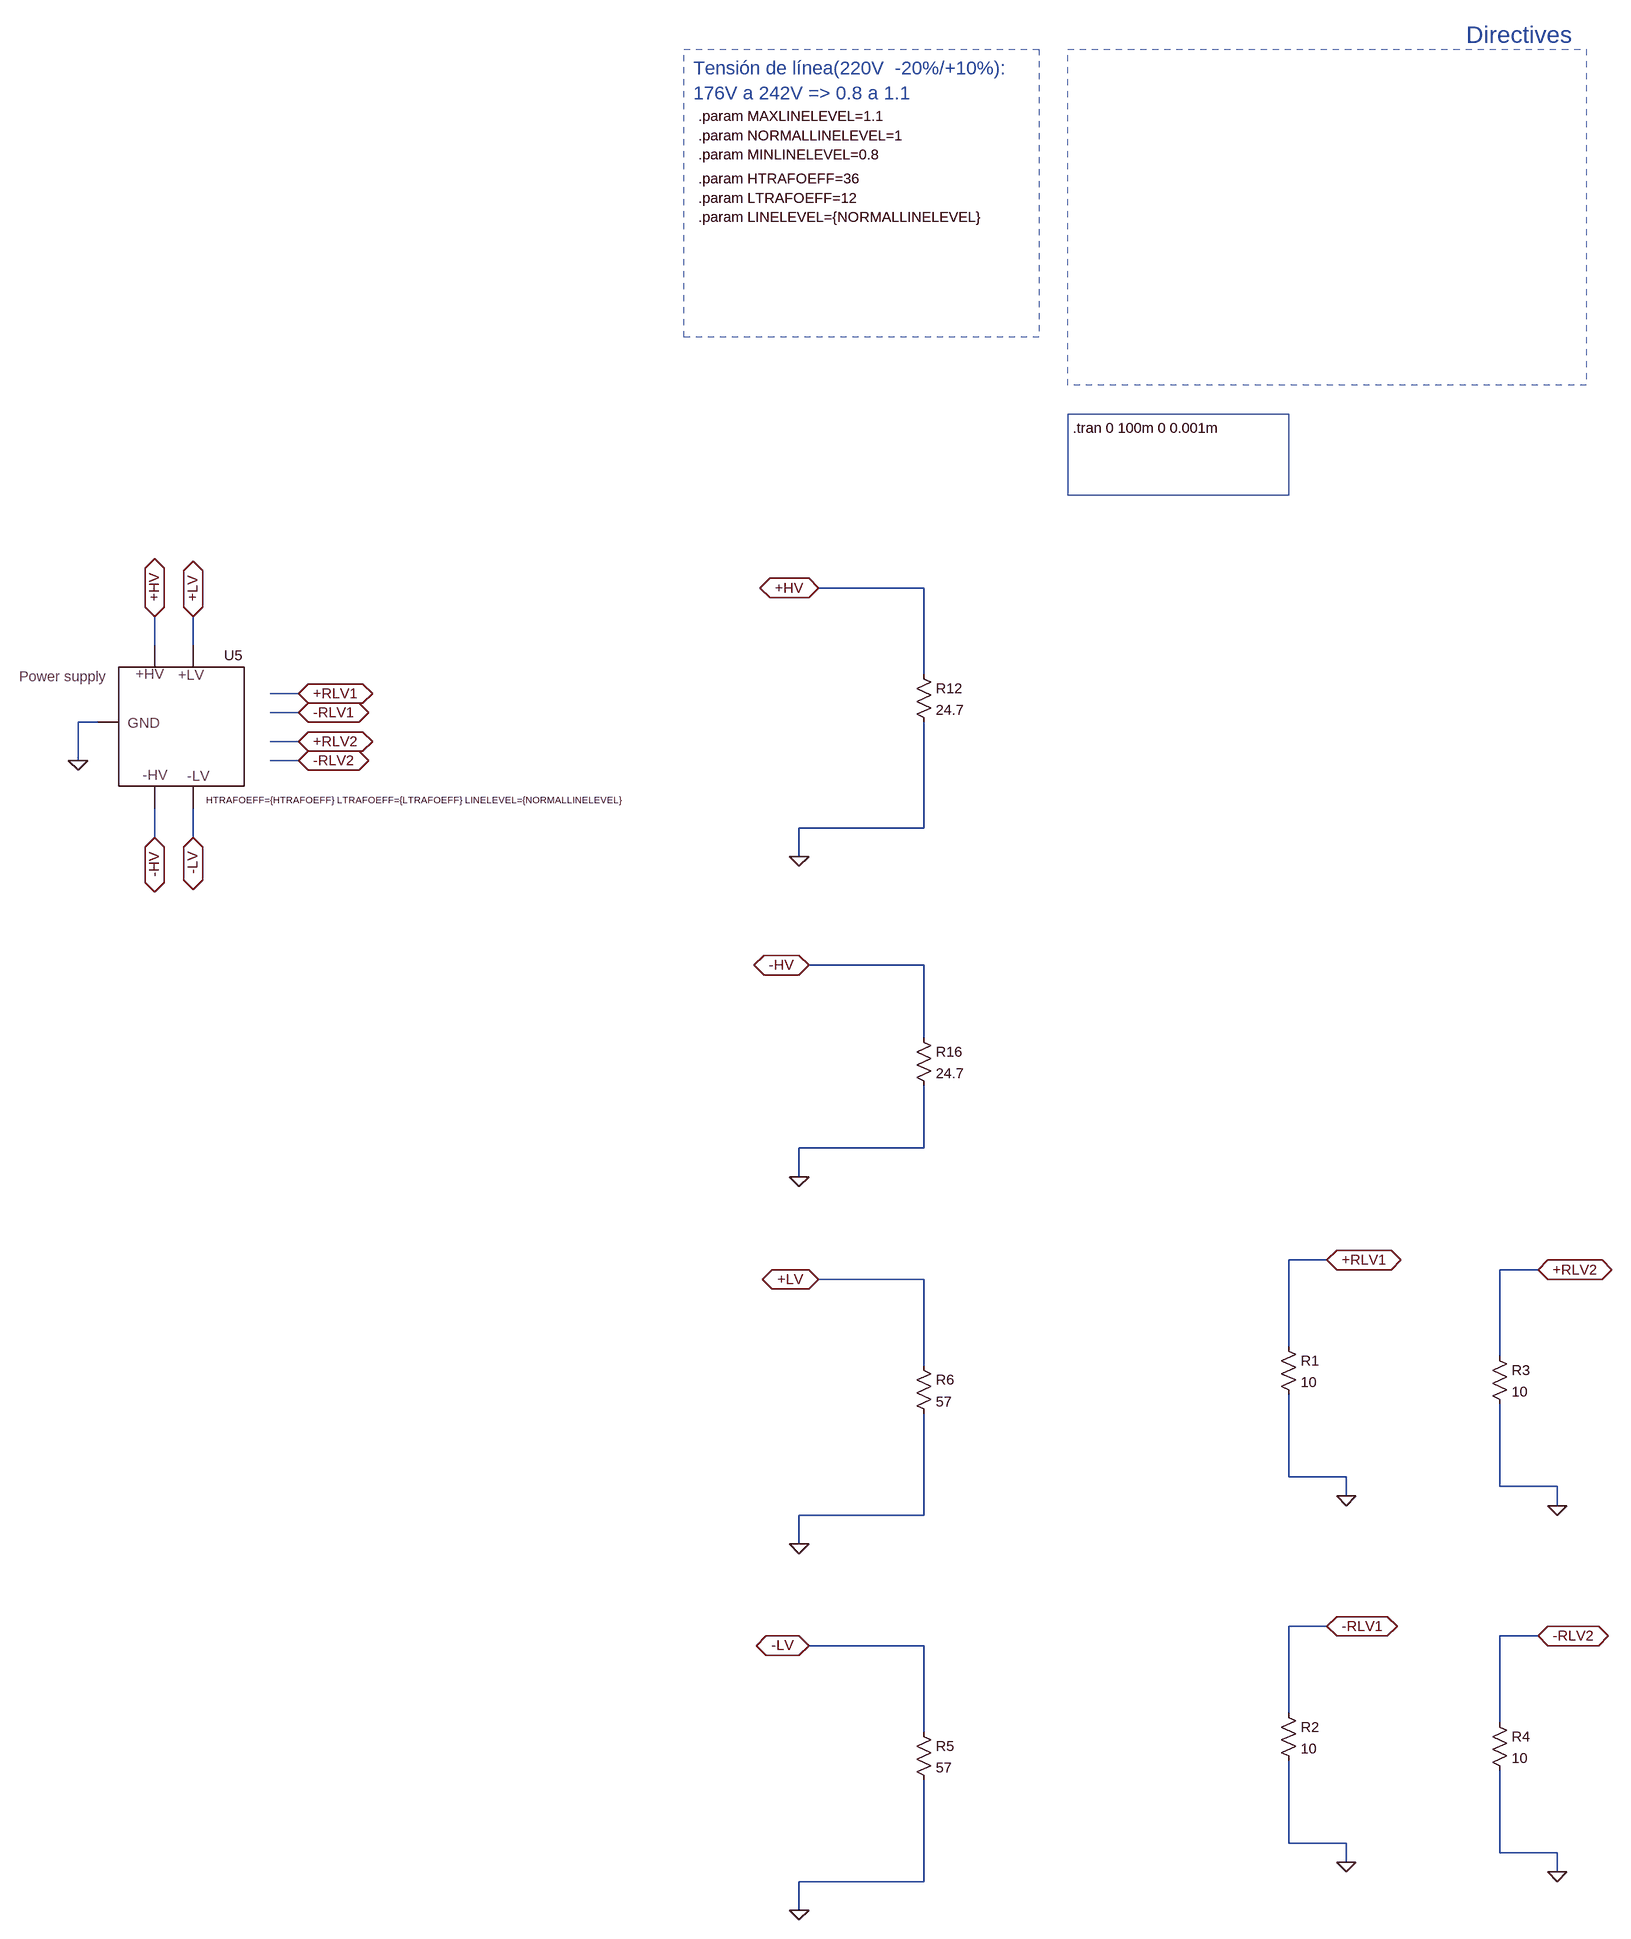
[diagram p0: schematic power_supply_V_2.0.asc]
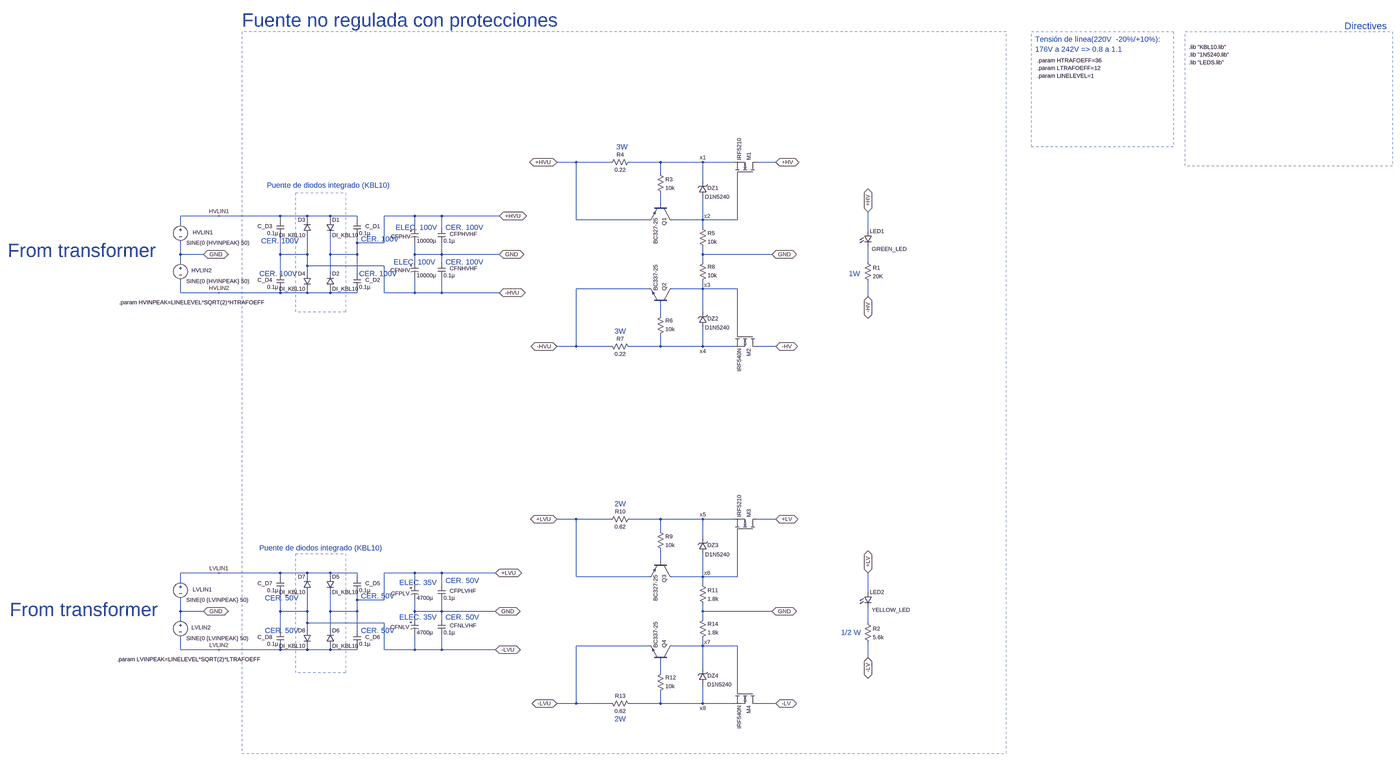
[diagram p1: sub-circuit power_supply_v_2.0_hb.asc, whole sheet]
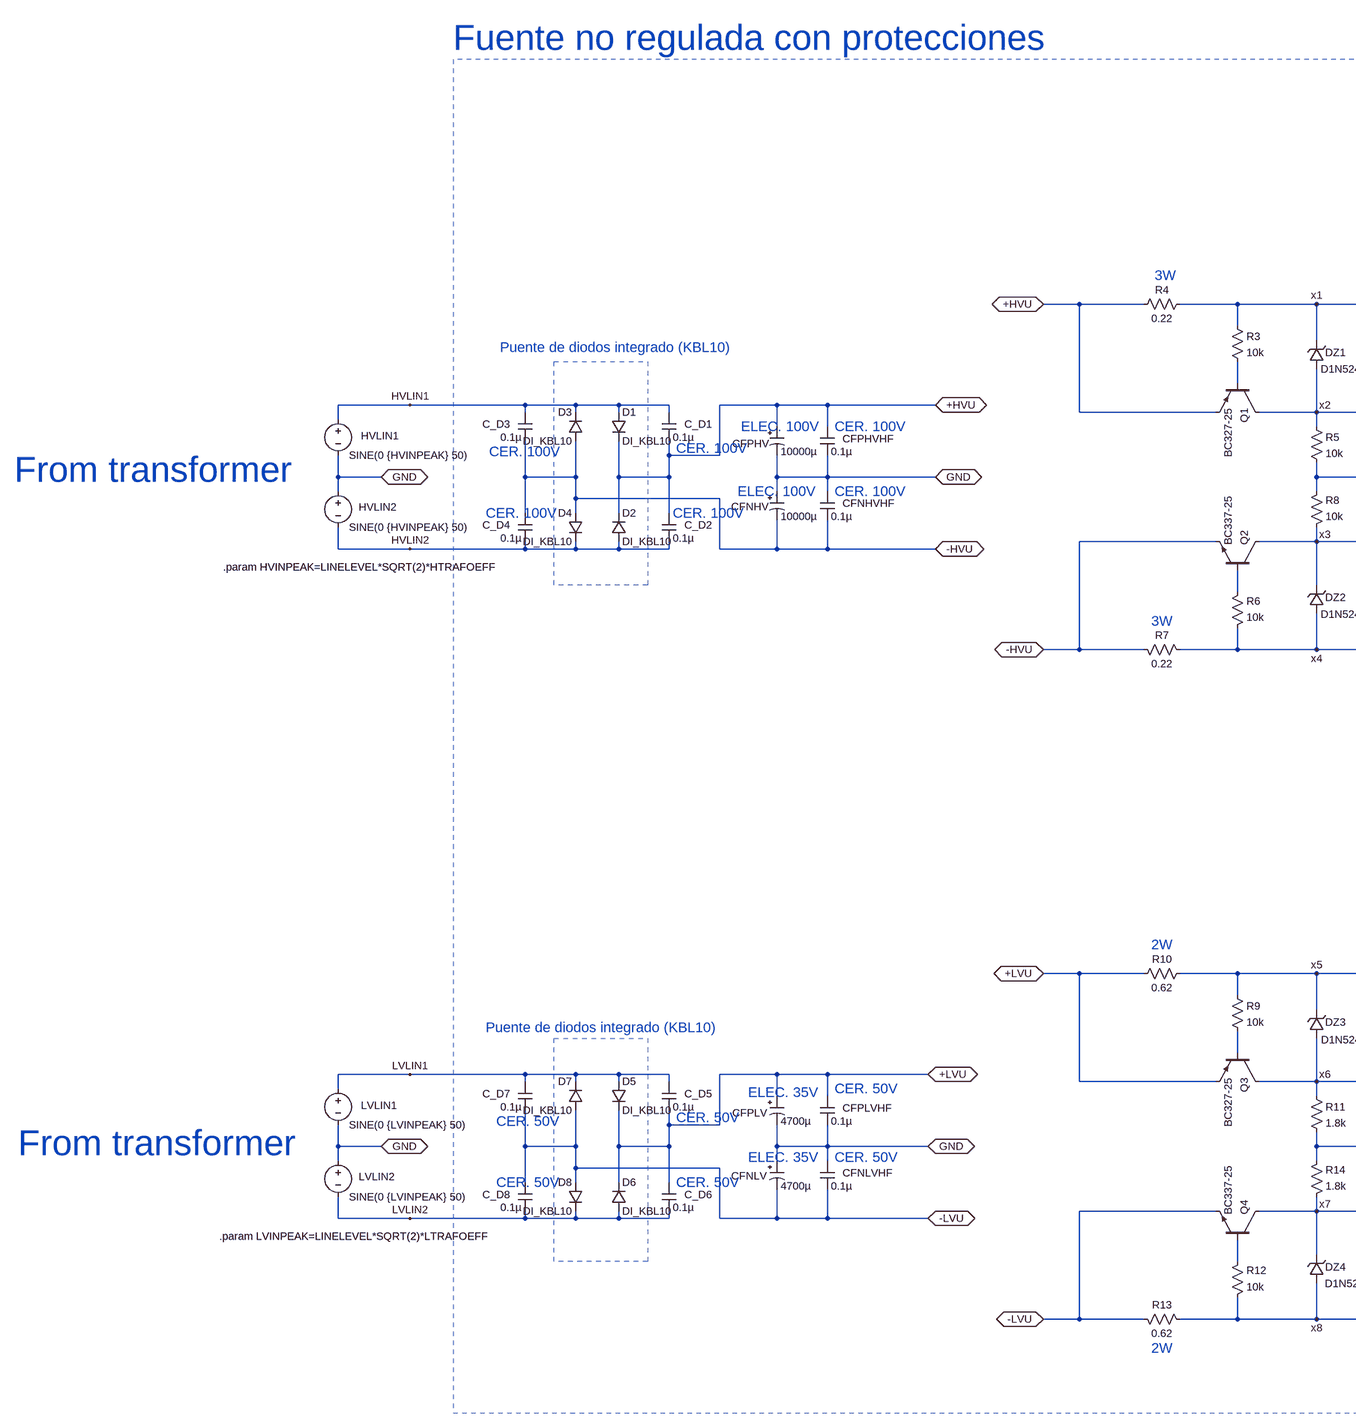
[diagram p2: sub-circuit power_supply_v_2.0_hb.asc, part, row 1 of 1, column 1 of 2]
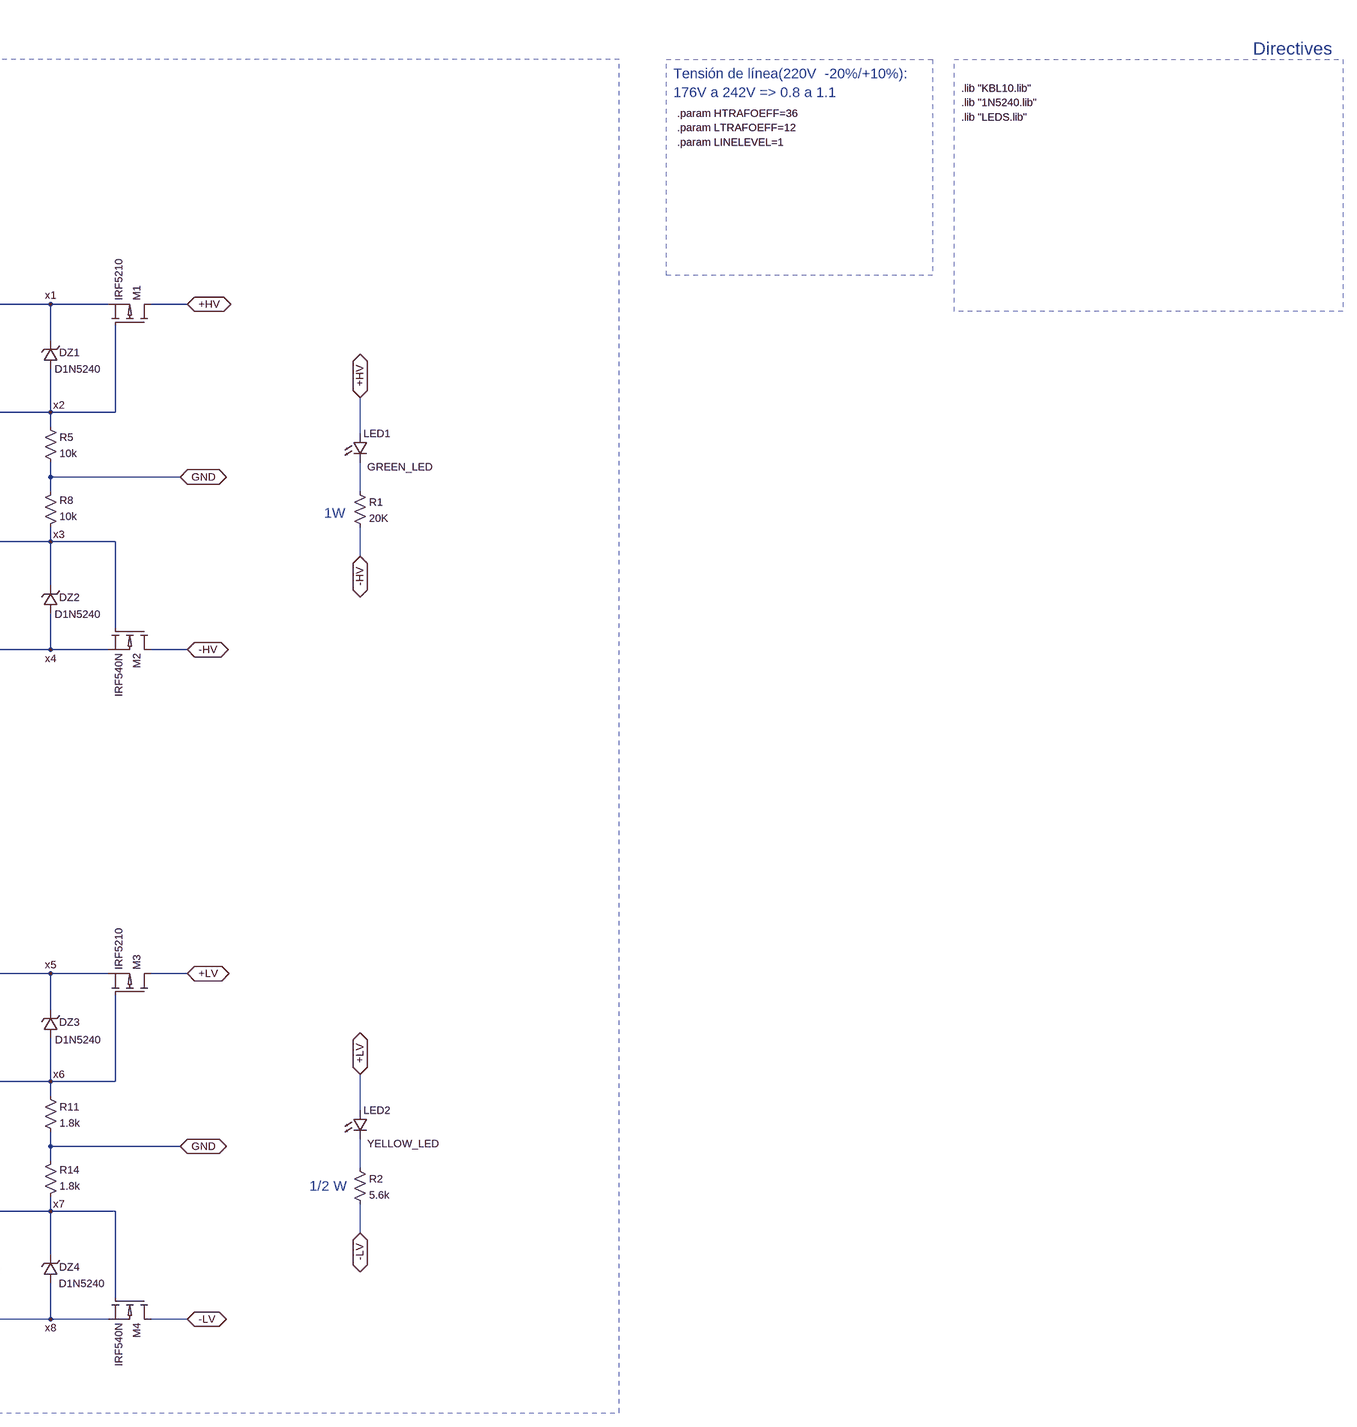
[diagram p3: sub-circuit power_supply_v_2.0_hb.asc, part, row 1 of 1, column 2 of 2]
power_supply_V_2.0.asc, the LTspice schematic file:
Version 4
SHEET 1 5728 3316
WIRE 3584 -688 3408 -688
WIRE 1920 -592 1920 -640
WIRE 1984 -592 1984 -640
WIRE 3584 -544 3584 -688
WIRE 2160 -512 2112 -512
WIRE 2160 -480 2112 -480
WIRE 1824 -464 1792 -464
WIRE 2160 -432 2112 -432
WIRE 1792 -400 1792 -464
WIRE 2160 -400 2112 -400
WIRE 3584 -288 3584 -464
WIRE 3584 -288 3376 -288
WIRE 1920 -272 1920 -320
WIRE 1984 -272 1984 -320
WIRE 3376 -240 3376 -288
WIRE 3584 16 3392 16
WIRE 3584 160 3584 16
WIRE 3584 416 3584 240
WIRE 3584 416 3376 416
WIRE 3376 464 3376 416
WIRE 4256 816 4192 816
WIRE 4608 832 4544 832
WIRE 3584 848 3408 848
WIRE 4192 960 4192 816
WIRE 4544 976 4544 832
WIRE 3584 992 3584 848
WIRE 4192 1184 4192 1040
WIRE 4288 1184 4192 1184
WIRE 4544 1200 4544 1056
WIRE 4640 1200 4544 1200
WIRE 4288 1216 4288 1184
WIRE 4640 1232 4640 1200
WIRE 3584 1248 3584 1072
WIRE 3584 1248 3376 1248
WIRE 3376 1296 3376 1248
WIRE 4256 1520 4192 1520
WIRE 4608 1536 4544 1536
WIRE 3584 1552 3392 1552
WIRE 4192 1664 4192 1520
WIRE 4544 1680 4544 1536
WIRE 3584 1696 3584 1552
WIRE 4192 1888 4192 1744
WIRE 4288 1888 4192 1888
WIRE 4544 1904 4544 1760
WIRE 4640 1904 4544 1904
WIRE 4288 1920 4288 1888
WIRE 4640 1936 4640 1904
WIRE 3584 1952 3584 1776
WIRE 3584 1952 3376 1952
WIRE 3376 2000 3376 1952
FLAG 3408 -688 +HV
IOPIN 3408 -688 BiDir
FLAG 3376 -240 0
FLAG 3392 16 -HV
IOPIN 3392 16 BiDir
FLAG 3376 464 0
FLAG 4256 816 +RLV1
IOPIN 4256 816 BiDir
FLAG 4288 1216 0
FLAG 4256 1520 -RLV1
IOPIN 4256 1520 BiDir
FLAG 4288 1920 0
FLAG 3408 848 +LV
IOPIN 3408 848 BiDir
FLAG 3376 1296 0
FLAG 3392 1552 -LV
IOPIN 3392 1552 BiDir
FLAG 3376 2000 0
FLAG 1792 -400 0
FLAG 1920 -640 +HV
IOPIN 1920 -640 BiDir
FLAG 1984 -640 +LV
IOPIN 1984 -640 BiDir
FLAG 1920 -272 -HV
IOPIN 1920 -272 BiDir
FLAG 1984 -272 -LV
IOPIN 1984 -272 BiDir
FLAG 2160 -432 +RLV2
IOPIN 2160 -432 BiDir
FLAG 2160 -400 -RLV2
IOPIN 2160 -400 BiDir
FLAG 4608 832 +RLV2
IOPIN 4608 832 BiDir
FLAG 4640 1232 0
FLAG 4608 1536 -RLV2
IOPIN 4608 1536 BiDir
FLAG 4640 1936 0
FLAG 2160 -512 +RLV1
IOPIN 2160 -512 BiDir
FLAG 2160 -480 -RLV1
IOPIN 2160 -480 BiDir
SYMBOL res 3568 -560 R0
SYMATTR InstName R12
SYMATTR Value 24.7
SYMBOL res 3568 144 R0
SYMATTR InstName R16
SYMATTR Value 24.7
SYMBOL power_supply_V_2.0_HB 1968 -448 R0
WINDOW 0 68 -127 Left 2
WINDOW 39 38 114 Left 1
SYMATTR InstName U5
SYMATTR SpiceLine HTRAFOEFF={HTRAFOEFF} LTRAFOEFF={LTRAFOEFF} LINELEVEL={NORMALLINELEVEL}
SYMBOL res 4176 944 R0
SYMATTR InstName R1
SYMATTR Value 10
SYMBOL res 4176 1648 R0
SYMATTR InstName R2
SYMATTR Value 10
SYMBOL res 4528 960 R0
SYMATTR InstName R3
SYMATTR Value 10
SYMBOL res 4528 1664 R0
SYMATTR InstName R4
SYMATTR Value 10
SYMBOL res 3568 1680 R0
SYMATTR InstName R5
SYMATTR Value 57
SYMBOL res 3568 976 R0
SYMATTR InstName R6
SYMATTR Value 57
TEXT 3832 -1064 Left 2 !.tran 0 100m 0 0.001m
TEXT 4488 -1720 Left 4 ;Directives
TEXT 3208 -1480 Left 2 !.param HTRAFOEFF=36
TEXT 3208 -1448 Left 2 !.param LTRAFOEFF=12
TEXT 3208 -1416 Left 2 !.param LINELEVEL={NORMALLINELEVEL}
TEXT 3200 -1664 Left 3 ;Tensión de línea(220V  -20%/+10%):\n176V a 242V => 0.8 a 1.1
TEXT 3208 -1584 Left 2 !.param MAXLINELEVEL=1.1
TEXT 3208 -1520 Left 2 !.param MINLINELEVEL=0.8
TEXT 3208 -1552 Left 2 !.param NORMALLINELEVEL=1
RECTANGLE Normal 4688 -1136 3824 -1696 3
RECTANGLE Normal 3776 -1216 3184 -1696 2
RECTANGLE Normal 4192 -928 3824 -1088

power_supply_v_2.0_hb.asc, the sub-circuit schematic file:
Version 4
SHEET 1 5728 3316
WIRE -2768 -480 -2848 -480
WIRE -2624 -480 -2768 -480
WIRE -2416 -480 -2544 -480
WIRE -2240 -480 -2416 -480
WIRE -2112 -480 -2240 -480
WIRE -1936 -480 -2016 -480
WIRE -2416 -432 -2416 -480
WIRE -2240 -400 -2240 -480
WIRE -2416 -304 -2416 -352
WIRE -4256 -256 -4416 -256
WIRE -4000 -256 -4256 -256
WIRE -3888 -256 -4000 -256
WIRE -3792 -256 -3888 -256
WIRE -3680 -256 -3792 -256
WIRE -3440 -256 -3568 -256
WIRE -3328 -256 -3440 -256
WIRE -3088 -256 -3328 -256
WIRE -4000 -240 -4000 -256
WIRE -3888 -240 -3888 -256
WIRE -3792 -240 -3792 -256
WIRE -3680 -240 -3680 -256
WIRE -2768 -240 -2768 -480
WIRE -2464 -240 -2768 -240
WIRE -2240 -240 -2240 -336
WIRE -2240 -240 -2368 -240
WIRE -2096 -240 -2096 -432
WIRE -2096 -240 -2240 -240
WIRE -4416 -224 -4416 -256
WIRE -3440 -208 -3440 -256
WIRE -3328 -208 -3328 -256
WIRE -2240 -208 -2240 -240
WIRE -1552 -192 -1552 -272
WIRE -3680 -144 -3680 -176
WIRE -3568 -144 -3568 -256
WIRE -3568 -144 -3680 -144
WIRE -4416 -96 -4416 -144
WIRE -4320 -96 -4416 -96
WIRE -4000 -96 -4000 -176
WIRE -3888 -96 -3888 -176
WIRE -3888 -96 -4000 -96
WIRE -3792 -96 -3792 -176
WIRE -3680 -96 -3680 -144
WIRE -3680 -96 -3792 -96
WIRE -3440 -96 -3440 -144
WIRE -3328 -96 -3328 -144
WIRE -3328 -96 -3440 -96
WIRE -3088 -96 -3328 -96
WIRE -2240 -96 -2240 -128
WIRE -1952 -96 -2240 -96
WIRE -4416 -64 -4416 -96
WIRE -3440 -64 -3440 -96
WIRE -3328 -64 -3328 -96
WIRE -2240 -64 -2240 -96
WIRE -1552 -64 -1552 -128
WIRE -3888 -48 -3888 -96
WIRE -3568 -48 -3888 -48
WIRE -4000 -16 -4000 -96
WIRE -3888 -16 -3888 -48
WIRE -3792 -16 -3792 -96
WIRE -3680 -16 -3680 -96
WIRE -2464 48 -2768 48
WIRE -2240 48 -2240 16
WIRE -2240 48 -2368 48
WIRE -2096 48 -2240 48
WIRE -4416 64 -4416 16
WIRE -4256 64 -4416 64
WIRE -4000 64 -4000 48
WIRE -4000 64 -4256 64
WIRE -3888 64 -3888 48
WIRE -3888 64 -4000 64
WIRE -3792 64 -3792 48
WIRE -3792 64 -3888 64
WIRE -3680 64 -3680 48
WIRE -3680 64 -3792 64
WIRE -3568 64 -3568 -48
WIRE -3440 64 -3440 0
WIRE -3440 64 -3568 64
WIRE -3328 64 -3328 0
WIRE -3328 64 -3440 64
WIRE -3088 64 -3328 64
WIRE -1552 80 -1552 16
WIRE -2240 144 -2240 48
WIRE -2416 160 -2416 112
WIRE -2096 240 -2096 48
WIRE -2768 288 -2768 48
WIRE -2768 288 -2848 288
WIRE -2624 288 -2768 288
WIRE -2416 288 -2416 240
WIRE -2416 288 -2544 288
WIRE -2240 288 -2240 208
WIRE -2240 288 -2416 288
WIRE -2112 288 -2240 288
WIRE -1936 288 -2016 288
WIRE -2768 1008 -2848 1008
WIRE -2624 1008 -2768 1008
WIRE -2416 1008 -2544 1008
WIRE -2240 1008 -2416 1008
WIRE -2112 1008 -2240 1008
WIRE -1936 1008 -2016 1008
WIRE -2416 1056 -2416 1008
WIRE -2240 1088 -2240 1008
WIRE -2416 1184 -2416 1136
WIRE -4256 1232 -4416 1232
WIRE -4000 1232 -4256 1232
WIRE -3888 1232 -4000 1232
WIRE -3792 1232 -3888 1232
WIRE -3680 1232 -3792 1232
WIRE -3440 1232 -3568 1232
WIRE -3328 1232 -3440 1232
WIRE -3104 1232 -3328 1232
WIRE -4000 1248 -4000 1232
WIRE -3888 1248 -3888 1232
WIRE -3792 1248 -3792 1232
WIRE -3680 1248 -3680 1232
WIRE -2768 1248 -2768 1008
WIRE -2464 1248 -2768 1248
WIRE -2240 1248 -2240 1152
WIRE -2240 1248 -2368 1248
WIRE -2096 1248 -2096 1056
WIRE -2096 1248 -2240 1248
WIRE -4416 1264 -4416 1232
WIRE -3440 1280 -3440 1232
WIRE -3328 1280 -3328 1232
WIRE -2240 1280 -2240 1248
WIRE -1552 1312 -1552 1232
WIRE -3680 1344 -3680 1312
WIRE -3568 1344 -3568 1232
WIRE -3568 1344 -3680 1344
WIRE -4416 1392 -4416 1344
WIRE -4320 1392 -4416 1392
WIRE -4000 1392 -4000 1312
WIRE -3888 1392 -3888 1312
WIRE -3888 1392 -4000 1392
WIRE -3792 1392 -3792 1312
WIRE -3680 1392 -3680 1344
WIRE -3680 1392 -3792 1392
WIRE -3440 1392 -3440 1344
WIRE -3328 1392 -3328 1344
WIRE -3328 1392 -3440 1392
WIRE -3104 1392 -3328 1392
WIRE -2240 1392 -2240 1360
WIRE -1952 1392 -2240 1392
WIRE -4416 1424 -4416 1392
WIRE -3440 1424 -3440 1392
WIRE -3328 1424 -3328 1392
WIRE -2240 1424 -2240 1392
WIRE -3888 1440 -3888 1392
WIRE -3568 1440 -3888 1440
WIRE -1552 1440 -1552 1376
WIRE -4000 1472 -4000 1392
WIRE -3888 1472 -3888 1440
WIRE -3792 1472 -3792 1392
WIRE -3680 1472 -3680 1392
WIRE -2464 1536 -2768 1536
WIRE -2240 1536 -2240 1504
WIRE -2240 1536 -2368 1536
WIRE -2096 1536 -2240 1536
WIRE -4416 1552 -4416 1504
WIRE -4256 1552 -4416 1552
WIRE -4000 1552 -4000 1536
WIRE -4000 1552 -4256 1552
WIRE -3888 1552 -3888 1536
WIRE -3888 1552 -4000 1552
WIRE -3792 1552 -3792 1536
WIRE -3792 1552 -3888 1552
WIRE -3680 1552 -3680 1536
WIRE -3680 1552 -3792 1552
WIRE -3568 1552 -3568 1440
WIRE -3440 1552 -3440 1488
WIRE -3440 1552 -3568 1552
WIRE -3328 1552 -3328 1488
WIRE -3328 1552 -3440 1552
WIRE -3104 1552 -3328 1552
WIRE -1552 1584 -1552 1520
WIRE -2240 1632 -2240 1536
WIRE -2416 1648 -2416 1600
WIRE -2096 1728 -2096 1536
WIRE -2768 1776 -2768 1536
WIRE -2768 1776 -2848 1776
WIRE -2624 1776 -2768 1776
WIRE -2416 1776 -2416 1728
WIRE -2416 1776 -2544 1776
WIRE -2240 1776 -2240 1696
WIRE -2240 1776 -2416 1776
WIRE -2112 1776 -2240 1776
WIRE -1936 1776 -2016 1776
FLAG -4256 -256 HVLIN1
FLAG -4256 64 HVLIN2
FLAG -3088 -256 +HVU
IOPIN -3088 -256 BiDir
FLAG -3088 64 -HVU
IOPIN -3088 64 BiDir
FLAG -4256 1232 LVLIN1
FLAG -4256 1552 LVLIN2
FLAG -3104 1232 +LVU
IOPIN -3104 1232 BiDir
FLAG -3104 1552 -LVU
IOPIN -3104 1552 BiDir
FLAG -4320 -96 GND
IOPIN -4320 -96 BiDir
FLAG -4320 1392 GND
IOPIN -4320 1392 BiDir
FLAG -3088 -96 GND
IOPIN -3088 -96 BiDir
FLAG -3104 1392 GND
IOPIN -3104 1392 BiDir
FLAG -1552 -272 +HV
IOPIN -1552 -272 BiDir
FLAG -1552 80 -HV
IOPIN -1552 80 BiDir
FLAG -1552 1232 +LV
IOPIN -1552 1232 BiDir
FLAG -1552 1584 -LV
IOPIN -1552 1584 BiDir
FLAG -1936 -480 +HV
IOPIN -1936 -480 BiDir
FLAG -2848 -480 +HVU
IOPIN -2848 -480 BiDir
FLAG -1936 288 -HV
IOPIN -1936 288 BiDir
FLAG -2848 288 -HVU
IOPIN -2848 288 BiDir
FLAG -1952 -96 GND
IOPIN -1952 -96 BiDir
FLAG -1936 1008 +LV
IOPIN -1936 1008 BiDir
FLAG -2848 1008 +LVU
IOPIN -2848 1008 BiDir
FLAG -1936 1776 -LV
IOPIN -1936 1776 BiDir
FLAG -2848 1776 -LVU
IOPIN -2848 1776 BiDir
FLAG -1952 1392 GND
IOPIN -1952 1392 BiDir
FLAG -2240 -480 x1
FLAG -2240 -240 x2
FLAG -2240 48 x3
FLAG -2240 288 x4
FLAG -2240 1008 x5
FLAG -2240 1248 x6
FLAG -2240 1536 x7
FLAG -2240 1776 x8
SYMBOL voltage -4416 -240 R0
WINDOW 123 0 0 Left 2
WINDOW 39 0 0 Left 2
WINDOW 0 51 53 Left 2
SYMATTR InstName HVLIN1
SYMATTR Value SINE(0 {HVINPEAK} 50)
SYMBOL diode -3808 -240 R0
SYMATTR InstName D1
SYMATTR Value DI_KBL10
SYMBOL diode -3808 48 M180
WINDOW 0 24 64 Left 2
WINDOW 3 24 0 Left 2
SYMATTR InstName D2
SYMATTR Value DI_KBL10
SYMBOL polcap -3456 -208 R0
WINDOW 0 -83 38 Left 2
WINDOW 3 24 56 Left 2
SYMATTR InstName CFPHV
SYMATTR Value 10000µ
SYMATTR Description Capacitor
SYMATTR Type cap
SYMATTR SpiceLine V=35 Irms=1.45 Rser=0.044 Lser=0 mfg="Nichicon" pn="UPR1V222MRH" type="Al electrolytic"
SYMBOL cap -3344 -208 R0
WINDOW 0 50 27 Left 2
SYMATTR InstName CFPHVHF
SYMATTR Value 0.1µ
SYMATTR SpiceLine V=4 Irms=1.62 Rser=0.0464862 Lser=0 mfg="KEMET" pn="C0402C104K7PAC" type="X5R"
SYMBOL diode -3872 -176 R180
WINDOW 0 24 64 Left 2
WINDOW 3 24 0 Left 2
SYMATTR InstName D3
SYMATTR Value DI_KBL10
SYMBOL diode -3872 -16 M0
SYMATTR InstName D4
SYMATTR Value DI_KBL10
SYMBOL voltage -4416 -80 R0
WINDOW 123 0 0 Left 2
WINDOW 39 0 0 Left 2
WINDOW 0 46 51 Left 2
SYMATTR InstName HVLIN2
SYMATTR Value SINE(0 {HVINPEAK} 50)
SYMBOL polcap -3456 -64 R0
WINDOW 0 -86 34 Left 2
WINDOW 3 24 56 Left 2
SYMATTR InstName CFNHV
SYMATTR Value 10000µ
SYMATTR Description Capacitor
SYMATTR Type cap
SYMATTR SpiceLine V=35 Irms=1.45 Rser=0.044 Lser=0 mfg="Nichicon" pn="UPR1V222MRH" type="Al electrolytic"
SYMBOL cap -3344 -64 R0
WINDOW 0 50 27 Left 2
SYMATTR InstName CFNHVHF
SYMATTR Value 0.1µ
SYMATTR SpiceLine V=4 Irms=1.62 Rser=0.0464862 Lser=0 mfg="KEMET" pn="C0402C104K7PAC" type="X5R"
SYMBOL cap -3696 -240 R0
WINDOW 0 50 27 Left 2
SYMATTR InstName C_D1
SYMATTR Value 0.1µ
SYMATTR SpiceLine V=4 Irms=1.62 Rser=0.0464862 Lser=0 mfg="KEMET" pn="C0402C104K7PAC" type="X5R"
SYMBOL cap -3696 -16 R0
WINDOW 0 50 27 Left 2
SYMATTR InstName C_D2
SYMATTR Value 0.1µ
SYMATTR SpiceLine V=4 Irms=1.62 Rser=0.0464862 Lser=0 mfg="KEMET" pn="C0402C104K7PAC" type="X5R"
SYMBOL cap -3984 -240 M0
WINDOW 0 50 27 Left 2
SYMATTR InstName C_D3
SYMATTR Value 0.1µ
SYMATTR SpiceLine V=4 Irms=1.62 Rser=0.0464862 Lser=0 mfg="KEMET" pn="C0402C104K7PAC" type="X5R"
SYMBOL cap -3984 -16 M0
WINDOW 0 50 27 Left 2
SYMATTR InstName C_D4
SYMATTR Value 0.1µ
SYMATTR SpiceLine V=4 Irms=1.62 Rser=0.0464862 Lser=0 mfg="KEMET" pn="C0402C104K7PAC" type="X5R"
SYMBOL voltage -4416 1248 R0
WINDOW 123 0 0 Left 2
WINDOW 39 0 0 Left 2
WINDOW 0 51 53 Left 2
SYMATTR InstName LVLIN1
SYMATTR Value SINE(0 {LVINPEAK} 50)
SYMBOL diode -3808 1248 R0
SYMATTR InstName D5
SYMATTR Value DI_KBL10
SYMBOL diode -3808 1536 M180
WINDOW 0 24 64 Left 2
WINDOW 3 24 0 Left 2
SYMATTR InstName D6
SYMATTR Value DI_KBL10
SYMBOL polcap -3456 1280 R0
WINDOW 0 -83 38 Left 2
WINDOW 3 24 56 Left 2
SYMATTR InstName CFPLV
SYMATTR Value 4700µ
SYMATTR Description Capacitor
SYMATTR Type cap
SYMATTR SpiceLine V=35 Irms=1.45 Rser=0.044 Lser=0 mfg="Nichicon" pn="UPR1V222MRH" type="Al electrolytic"
SYMBOL cap -3344 1280 R0
WINDOW 0 50 27 Left 2
SYMATTR InstName CFPLVHF
SYMATTR Value 0.1µ
SYMATTR SpiceLine V=4 Irms=1.62 Rser=0.0464862 Lser=0 mfg="KEMET" pn="C0402C104K7PAC" type="X5R"
SYMBOL diode -3872 1312 R180
WINDOW 0 24 64 Left 2
WINDOW 3 24 0 Left 2
SYMATTR InstName D7
SYMATTR Value DI_KBL10
SYMBOL diode -3872 1472 M0
SYMATTR InstName D8
SYMATTR Value DI_KBL10
SYMBOL voltage -4416 1408 R0
WINDOW 123 0 0 Left 2
WINDOW 39 0 0 Left 2
WINDOW 0 46 51 Left 2
SYMATTR InstName LVLIN2
SYMATTR Value SINE(0 {LVINPEAK} 50)
SYMBOL polcap -3456 1424 R0
WINDOW 0 -86 34 Left 2
WINDOW 3 24 56 Left 2
SYMATTR InstName CFNLV
SYMATTR Value 4700µ
SYMATTR Description Capacitor
SYMATTR Type cap
SYMATTR SpiceLine V=35 Irms=1.45 Rser=0.044 Lser=0 mfg="Nichicon" pn="UPR1V222MRH" type="Al electrolytic"
SYMBOL cap -3344 1424 R0
WINDOW 0 50 27 Left 2
SYMATTR InstName CFNLVHF
SYMATTR Value 0.1µ
SYMATTR SpiceLine V=4 Irms=1.62 Rser=0.0464862 Lser=0 mfg="KEMET" pn="C0402C104K7PAC" type="X5R"
SYMBOL cap -3696 1248 R0
WINDOW 0 50 27 Left 2
SYMATTR InstName C_D5
SYMATTR Value 0.1µ
SYMATTR SpiceLine V=4 Irms=1.62 Rser=0.0464862 Lser=0 mfg="KEMET" pn="C0402C104K7PAC" type="X5R"
SYMBOL cap -3696 1472 R0
WINDOW 0 50 27 Left 2
SYMATTR InstName C_D6
SYMATTR Value 0.1µ
SYMATTR SpiceLine V=4 Irms=1.62 Rser=0.0464862 Lser=0 mfg="KEMET" pn="C0402C104K7PAC" type="X5R"
SYMBOL cap -3984 1248 M0
WINDOW 0 50 27 Left 2
SYMATTR InstName C_D7
SYMATTR Value 0.1µ
SYMATTR SpiceLine V=4 Irms=1.62 Rser=0.0464862 Lser=0 mfg="KEMET" pn="C0402C104K7PAC" type="X5R"
SYMBOL cap -3984 1472 M0
WINDOW 0 50 27 Left 2
SYMATTR InstName C_D8
SYMATTR Value 0.1µ
SYMATTR SpiceLine V=4 Irms=1.62 Rser=0.0464862 Lser=0 mfg="KEMET" pn="C0402C104K7PAC" type="X5R"
SYMBOL LED -1568 -192 R0
WINDOW 3 32 74 Left 2
SYMATTR Value GREEN_LED
SYMATTR InstName LED1
SYMBOL res -1568 -80 R0
SYMATTR InstName R1
SYMATTR Value 20K
SYMBOL LED -1568 1312 R0
WINDOW 3 32 74 Left 2
SYMATTR Value YELLOW_LED
SYMATTR InstName LED2
SYMBOL res -1568 1424 R0
SYMATTR InstName R2
SYMATTR Value 5.6k
SYMBOL pnp -2368 -304 R90
SYMATTR InstName Q1
SYMATTR Value BC327-25
SYMBOL res -2432 -448 R0
SYMATTR InstName R3
SYMATTR Value 10k
SYMBOL res -2528 -496 R90
WINDOW 0 0 56 VBottom 2
WINDOW 3 32 56 VTop 2
SYMATTR InstName R4
SYMATTR Value 0.22
SYMBOL res -2256 -224 R0
SYMATTR InstName R5
SYMATTR Value 10k
SYMBOL res -2432 256 M180
WINDOW 0 36 76 Left 2
WINDOW 3 36 40 Left 2
SYMATTR InstName R6
SYMATTR Value 10k
SYMBOL res -2528 304 M270
WINDOW 0 32 56 VTop 2
WINDOW 3 0 56 VBottom 2
SYMATTR InstName R7
SYMATTR Value 0.22
SYMBOL res -2256 32 M180
WINDOW 0 36 76 Left 2
WINDOW 3 36 40 Left 2
SYMATTR InstName R8
SYMATTR Value 10k
SYMBOL npn -2368 112 M270
SYMATTR InstName Q2
SYMATTR Value BC337-25
SYMBOL pnp -2368 1184 R90
SYMATTR InstName Q3
SYMATTR Value BC327-25
SYMBOL res -2432 1040 R0
SYMATTR InstName R9
SYMATTR Value 10k
SYMBOL res -2528 992 R90
WINDOW 0 0 56 VBottom 2
WINDOW 3 32 56 VTop 2
SYMATTR InstName R10
SYMATTR Value 0.62
SYMBOL res -2256 1264 R0
SYMATTR InstName R11
SYMATTR Value 1.8k
SYMBOL res -2432 1744 M180
WINDOW 0 36 76 Left 2
WINDOW 3 36 40 Left 2
SYMATTR InstName R12
SYMATTR Value 10k
SYMBOL res -2528 1792 M270
WINDOW 0 32 56 VTop 2
WINDOW 3 0 56 VBottom 2
SYMATTR InstName R13
SYMATTR Value 0.62
SYMBOL res -2256 1520 M180
WINDOW 0 36 76 Left 2
WINDOW 3 36 40 Left 2
SYMATTR InstName R14
SYMATTR Value 1.8k
SYMBOL npn -2368 1600 M270
SYMATTR InstName Q4
SYMATTR Value BC337-25
SYMBOL IRF5210 -2016 -432 M270
SYMATTR InstName M1
SYMBOL IRF5210 -2016 1056 M270
SYMATTR InstName M3
SYMBOL IRF540N -2016 240 R90
SYMATTR InstName M2
SYMBOL IRF540N -2016 1728 R90
SYMATTR InstName M4
SYMBOL zener -2224 -336 R180
WINDOW 0 -49 36 Left 2
WINDOW 3 -95 0 Left 2
SYMATTR InstName DZ1
SYMATTR Value D1N5240
SYMATTR Prefix X
SYMBOL zener -2224 208 R180
WINDOW 0 -49 36 Left 2
WINDOW 3 -95 -1 Left 2
SYMATTR InstName DZ2
SYMATTR Value D1N5240
SYMATTR Prefix X
SYMBOL zener -2224 1152 R180
WINDOW 0 -49 36 Left 2
WINDOW 3 -96 -3 Left 2
SYMATTR InstName DZ3
SYMATTR Value D1N5240
SYMATTR Prefix X
SYMBOL zener -2224 1696 R180
WINDOW 0 -49 36 Left 2
WINDOW 3 -104 -1 Left 2
SYMATTR InstName DZ4
SYMATTR Value D1N5240
SYMATTR Prefix X
TEXT -5136 -112 Left 6 ;From transformer
TEXT 488 -1048 Left 4 ;Directives
TEXT -792 -904 Left 2 !.param HTRAFOEFF=36
TEXT -792 -872 Left 2 !.param LTRAFOEFF=12
TEXT -792 -840 Left 2 !.param LINELEVEL=1
TEXT -800 -992 Left 3 ;Tensión de línea(220V  -20%/+10%):\n176V a 242V => 0.8 a 1.1
TEXT -4672 104 Left 2 !.param HVINPEAK=LINELEVEL*SQRT(2)*HTRAFOEFF
TEXT -4680 1592 Left 2 !.param LVINPEAK=LINELEVEL*SQRT(2)*LTRAFOEFF
TEXT -5128 1384 Left 6 ;From transformer
TEXT -3520 -208 Left 3 ;ELEC. 100V
TEXT -3528 -64 Left 3 ;ELEC. 100V
TEXT -3312 -208 Left 3 ;CER. 100V
TEXT -3312 -64 Left 3 ;CER. 100V
TEXT -3312 1264 Left 3 ;CER. 50V
TEXT -3504 1272 Left 3 ;ELEC. 35V
TEXT -3504 1416 Left 3 ;ELEC. 35V
TEXT -3312 1416 Left 3 ;CER. 50V
TEXT -4056 -384 Left 3 ;Puente de diodos integrado (KBL10)
TEXT -4080 -152 Left 3 ;CER. 100V
TEXT -4088 -16 Left 3 ;CER. 100V
TEXT -3672 -16 Left 3 ;CER. 100V
TEXT -3664 -160 Left 3 ;CER. 100V
TEXT -4064 1336 Left 3 ;CER. 50V
TEXT -4064 1472 Left 3 ;CER. 50V
TEXT -3664 1328 Left 3 ;CER. 50V
TEXT -3664 1472 Left 3 ;CER. 50V
TEXT -4088 1128 Left 3 ;Puente de diodos integrado (KBL10)
TEXT -160 -960 Left 2 !.lib "KBL10.lib"
TEXT -160 -928 Left 2 !.lib "1N5240.lib"
TEXT -1632 -16 Left 3 ;1W
TEXT -1664 1480 Left 3 ;1/2 W
TEXT -160 -896 Left 2 !.lib "LEDS.lib"
TEXT -4160 -1072 Left 6 ;Fuente no regulada con protecciones
TEXT -2608 944 Left 3 ;2W
TEXT -2608 1840 Left 3 ;2W
TEXT -2600 -544 Left 3 ;3W
TEXT -2608 224 Left 3 ;3W
RECTANGLE Normal 688 -464 -176 -1024 3
RECTANGLE Normal -224 -544 -816 -1024 2
RECTANGLE Normal -3728 144 -3936 -352 2
RECTANGLE Normal -3728 1648 -3936 1152 2
RECTANGLE Normal -4160 1984 -976 -1024 2

The netlist it stands for:
* power_supply_V_2.0.asc
R12 +HV 0 24.7
R16 -HV 0 24.7
XU5 0 +HV +LV -HV -LV power_supply_v_2.0_hb params: HTRAFOEFF={HTRAFOEFF} LTRAFOEFF={LTRAFOEFF} LINELEVEL={NORMALLINELEVEL}
R1 +RLV1 0 10
R2 -RLV1 0 10
R3 +RLV2 0 10
R4 -RLV2 0 10
R5 -LV 0 57
R6 +LV 0 57

* block symbol definitions
.subckt power_supply_v_2.0_hb GND +HV +LV -HV -LV
V§HVLIN1 HVLIN1 GND SINE(0 {HVINPEAK} 50)
D1 HVLIN1 +HVU DI_KBL10
D2 HVLIN2 +HVU DI_KBL10
CFPHV +HVU GND 10000µ V=35 Irms=1.45 Rser=0.044 Lser=0 mfg="Nichicon" pn="UPR1V222MRH" type="Al electrolytic"
CFPHVHF +HVU GND 0.1µ V=4 Irms=1.62 Rser=0.0464862 Lser=0 mfg="KEMET" pn="C0402C104K7PAC" type="X5R"
D3 -HVU HVLIN1 DI_KBL10
D4 -HVU HVLIN2 DI_KBL10
V§HVLIN2 GND HVLIN2 SINE(0 {HVINPEAK} 50)
CFNHV GND -HVU 10000µ V=35 Irms=1.45 Rser=0.044 Lser=0 mfg="Nichicon" pn="UPR1V222MRH" type="Al electrolytic"
CFNHVHF GND -HVU 0.1µ V=4 Irms=1.62 Rser=0.0464862 Lser=0 mfg="KEMET" pn="C0402C104K7PAC" type="X5R"
C_D1 HVLIN1 +HVU 0.1µ V=4 Irms=1.62 Rser=0.0464862 Lser=0 mfg="KEMET" pn="C0402C104K7PAC" type="X5R"
C_D2 +HVU HVLIN2 0.1µ V=4 Irms=1.62 Rser=0.0464862 Lser=0 mfg="KEMET" pn="C0402C104K7PAC" type="X5R"
C_D3 HVLIN1 -HVU 0.1µ V=4 Irms=1.62 Rser=0.0464862 Lser=0 mfg="KEMET" pn="C0402C104K7PAC" type="X5R"
C_D4 -HVU HVLIN2 0.1µ V=4 Irms=1.62 Rser=0.0464862 Lser=0 mfg="KEMET" pn="C0402C104K7PAC" type="X5R"
V§LVLIN1 LVLIN1 GND SINE(0 {LVINPEAK} 50)
D5 LVLIN1 +LVU DI_KBL10
D6 LVLIN2 +LVU DI_KBL10
CFPLV +LVU GND 4700µ V=35 Irms=1.45 Rser=0.044 Lser=0 mfg="Nichicon" pn="UPR1V222MRH" type="Al electrolytic"
CFPLVHF +LVU GND 0.1µ V=4 Irms=1.62 Rser=0.0464862 Lser=0 mfg="KEMET" pn="C0402C104K7PAC" type="X5R"
D7 -LVU LVLIN1 DI_KBL10
D8 -LVU LVLIN2 DI_KBL10
V§LVLIN2 GND LVLIN2 SINE(0 {LVINPEAK} 50)
CFNLV GND -LVU 4700µ V=35 Irms=1.45 Rser=0.044 Lser=0 mfg="Nichicon" pn="UPR1V222MRH" type="Al electrolytic"
CFNLVHF GND -LVU 0.1µ V=4 Irms=1.62 Rser=0.0464862 Lser=0 mfg="KEMET" pn="C0402C104K7PAC" type="X5R"
C_D5 LVLIN1 +LVU 0.1µ V=4 Irms=1.62 Rser=0.0464862 Lser=0 mfg="KEMET" pn="C0402C104K7PAC" type="X5R"
C_D6 +LVU LVLIN2 0.1µ V=4 Irms=1.62 Rser=0.0464862 Lser=0 mfg="KEMET" pn="C0402C104K7PAC" type="X5R"
C_D7 LVLIN1 -LVU 0.1µ V=4 Irms=1.62 Rser=0.0464862 Lser=0 mfg="KEMET" pn="C0402C104K7PAC" type="X5R"
C_D8 -LVU LVLIN2 0.1µ V=4 Irms=1.62 Rser=0.0464862 Lser=0 mfg="KEMET" pn="C0402C104K7PAC" type="X5R"
D§LED1 +HV N002 GREEN_LED
R1 N002 -HV 20K
D§LED2 +LV N005 YELLOW_LED
R2 N005 -LV 5.6k
Q1 x2 N001 +HVU 0 BC327-25
R3 x1 N001 10k
R4 x1 +HVU 0.22
R5 x2 GND 10k
R6 x4 N003 10k
R7 x4 -HVU 0.22
R8 x3 GND 10k
Q2 x3 N003 -HVU 0 BC337-25
Q3 x6 N004 +LVU 0 BC327-25
R9 x5 N004 10k
R10 x5 +LVU 0.62
R11 x6 GND 1.8k
R12 x8 N006 10k
R13 x8 -LVU 0.62
R14 x7 GND 1.8k
Q4 x7 N006 -LVU 0 BC337-25
XM1 +HV x2 x1 IRF5210  ; pins XD XG XS
XM3 +LV x6 x5 IRF5210  ; pins XD XG XS
XM2 -HV x3 x4 IRF540N  ; pins XD XG XS
XM4 -LV x7 x8 IRF540N  ; pins XD XG XS
XDZ1 x2 x1 D1N5240  ; pins + -
XDZ2 x4 x3 D1N5240  ; pins + -
XDZ3 x6 x5 D1N5240  ; pins + -
XDZ4 x8 x7 D1N5240  ; pins + -
* From transformer
* Directives
.param HTRAFOEFF=36
.param LTRAFOEFF=12
.param LINELEVEL=1
* Tensión de línea(220V  -20%/+10%):
* 176V a 242V => 0.8 a 1.1
.param HVINPEAK=LINELEVEL*SQRT(2)*HTRAFOEFF
.param LVINPEAK=LINELEVEL*SQRT(2)*LTRAFOEFF
* From transformer
* ELEC. 100V
* ELEC. 100V
* CER. 100V
* CER. 100V
* CER. 50V
* ELEC. 35V
* ELEC. 35V
* CER. 50V
* Puente de diodos integrado (KBL10)
* CER. 100V
* CER. 100V
* CER. 100V
* CER. 100V
* CER. 50V
* CER. 50V
* CER. 50V
* CER. 50V
* Puente de diodos integrado (KBL10)
.lib "KBL10.lib"
.lib "1N5240.lib"
* 1W
* 1/2 W
.lib "LEDS.lib"
* Fuente no regulada con protecciones
* 2W
* 2W
* 3W
* 3W
.ends power_supply_v_2.0_hb

.model D D
.lib standard.dio
.model NPN NPN
.model PNP PNP
.lib standard.bjt
.tran 0 100m 0 0.001m
* Directives
.param HTRAFOEFF=36
.param LTRAFOEFF=12
.param LINELEVEL={NORMALLINELEVEL}
* Tensión de línea(220V  -20%/+10%):
* 176V a 242V => 0.8 a 1.1
.param MAXLINELEVEL=1.1
.param MINLINELEVEL=0.8
.param NORMALLINELEVEL=1
.lib IRF5210.lib
.lib IRF540N.lib
.backanno
.end